# EAGLE design pj9 (EAGLE 7.3.2)
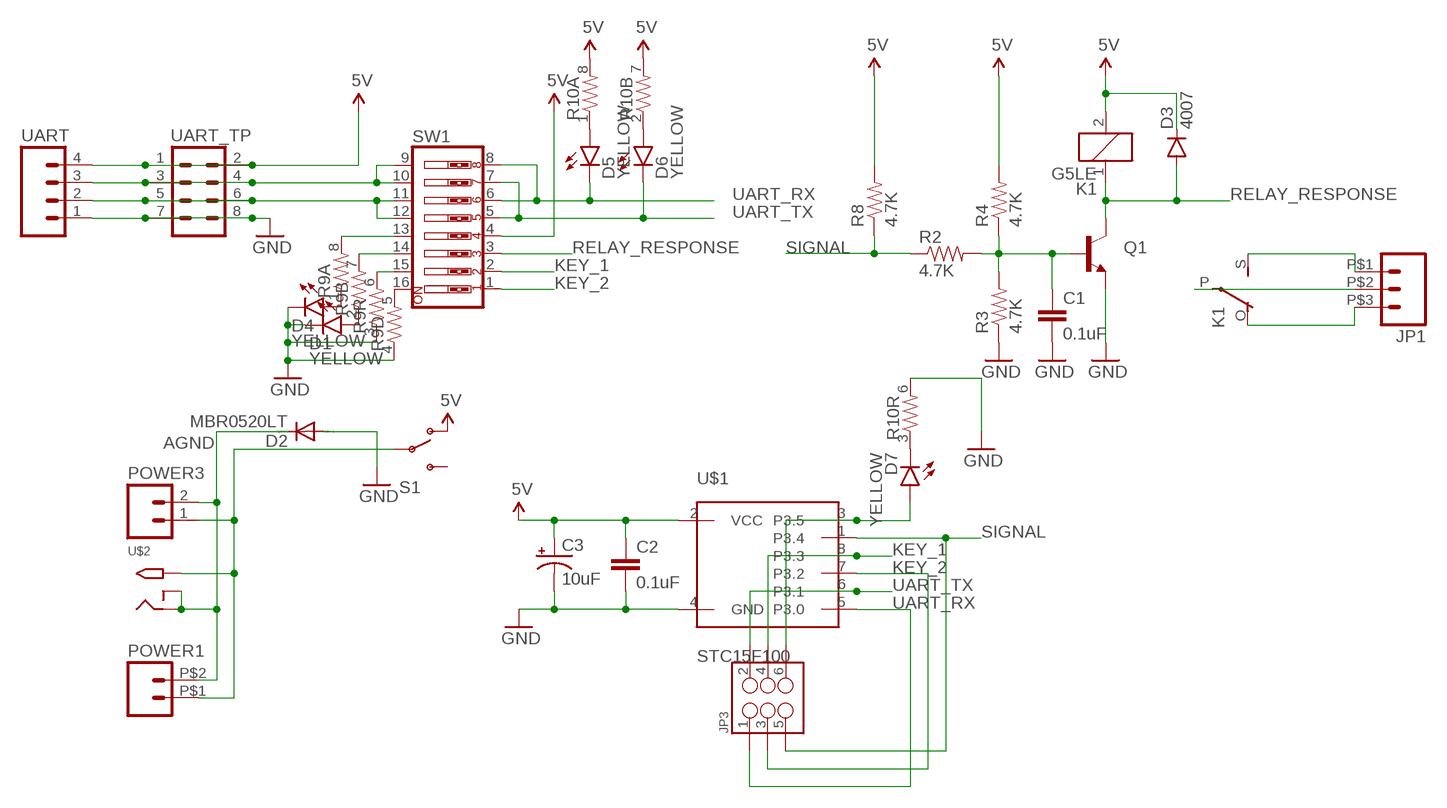
[diagram p0: schematic, sheet 1]

## Parts
C1  0.1uF  0.1UF-25V(+80/-20%)(0603)  [0603-CAP]
C2  0.1uF  0.1UF-25V(+80/-20%)(0603)  [0603-CAP]
C3  10uF  10UF-16V-10%(TANT)  [EIA3216]
D1  YELLOW  LED-YELLOW1206  [LED-1206]
D2  MBR0520LT  [SOD123]
D3  4007  DIODESMA-ALT  [SMA-DIODE_ALT]
D4  YELLOW  LED-YELLOW1206  [LED-1206]
D5  YELLOW  LED-YELLOW1206  [LED-1206]
D6  YELLOW  LED-YELLOW1206  [LED-1206]
D7  YELLOW  LED-YELLOW1206  [LED-1206]
JP1  M035.08  [1X03_5.08]
JP3  M03X2  [2X3_SMD]
K1  G5LE  [G5LE]
POWER1  M02  [1X02_5.08]
POWER3  M02LOCK  [1X02_LOCK]
Q1  TRANSISTOR_NPNSOT23-3  [SOT23-3]
R2  4.7K  470OHM1/10W1%(0603)  [0603-RES]
R3  4.7K  470OHM1/10W1%(0603)  [0603-RES]
R4  4.7K  470OHM1/10W1%(0603)  [0603-RES]
R8  4.7K  470OHM1/10W1%(0603)  [0603-RES]
R9  RESISTOR-ARRAY0603-ARV  [0603-ARV]
R10  RESISTOR-ARRAY0603-ARV  [0603-ARV]
S1  SWITCH-SPDTSMD  [AYZ0202]
SW1  SW_DIP-8-SMT-HALFSIZE  [DIPSWITCH-08-50MIL]
U$1  STC15F100  [SO08-TIGHT]
U$2  2.1MMJACK  [PJ-102A]
UART  M04LOCK  [1X04_LOCK]
UART_TP  M04X2SMD  [2X4_SMD]

## Nets
5V: C2.1 C3.A(+) D3.C K1.2 R4.2 R8.2 R10.7 R10.8 S1.1(O) SW1.4 U$1.2(VCC) UART.4 UART_TP.1 UART_TP.2
AGND: D2.C POWER1.P$2 POWER3.2 U$2.RING U$2.RING_SW
GND: C1.2 C2.2 C3.C(-) D1.C D2.A D4.C Q1.2(E) R3.1 R9.3 R9.4 R10.6 U$1.4(GND) UART.1 UART_TP.7 UART_TP.8
KEY_1: JP3.4 SW1.2 U$1.8(P3.3)
KEY_2: JP3.3 SW1.1 U$1.7(P3.2)
N$3: SW1.11 SW1.12 UART.2 UART_TP.5 UART_TP.6
N$4: R9.8 SW1.13
N$5: R9.5 SW1.16
N$8: SW1.9 SW1.10 UART.3 UART_TP.3 UART_TP.4
N$10: C1.1 Q1.1(B) R2.2 R3.2 R4.1
N$11: R9.7 SW1.14
N$12: JP1.P$2 K1.P(2:P)
N$13: JP1.P$1 K1.S(2:S)
N$14: JP1.P$3 K1.O(2:O)
N$15: R9.6 SW1.15
N$16: D5.A R10.1
N$17: D6.A R10.2
N$18: D4.A R9.1
N$19: D1.A R9.2
N$20: POWER1.P$1 POWER3.1 S1.2(P) U$2.TIP
N$21: D7.C R10.3
N$23: D7.A JP3.6 U$1.3(P3.5)
RELAY_RESPONSE: D3.A K1.1 Q1.3(C) SW1.3
SIGNAL: JP3.5 R2.1 R8.1 U$1.1(P3.4)
UART_RX: D5.C JP3.1 SW1.6 SW1.8 U$1.5(P3.0)
UART_TX: D6.C JP3.2 SW1.5 SW1.7 U$1.6(P3.1)
Unconnected: R10.4 R10.5 S1.3(S)

## Library data of the parts
C1 C2 = SparkFun-Capacitors:0.1UF-25V(+80/-20%)(0603): CAP-00810 Ceramic Standard decoupling cap; PROD_ID: CAP-00810
C3 = SparkFun-Capacitors:10UF-16V-10%(TANT): CAP-00811 1206/EIA-3216 Tantalum capacitor; PROD_ID: CAP-00811
D1 D4-D7 = SparkFun-LED:LED-YELLOW: Yellow SMD LEDs LilyPad 1206- DIO-09909 0603- DIO-09003 "SMART" means more efficient and expensive; PROD_ID: DIO-00820
D2 = diode:MBR0520LT: SCHOTTKY BARRIER RECTIFIER Source: http://onsemi.com .. MBR0520LT1-D.pdf
D3 = SparkFun-DiscreteSemi:DIODE: Diode These are standard reverse protection diodes and small signal diodes. SMA package can handle up to about 1A. SOD-323 can handle about 200mA. What the SOD-323 package when ordering, there are some mfgs out there that are 5-pin packages.
JP1 = SparkFun-Connectors:M03: Header 3 Standard 3-pin 0.1" header. Use with straight break away headers (SKU : PRT-00116), right angle break away headers (PRT-00553), swiss pins (PRT-00743), machine pins (PRT-00117), and female headers (PRT-00115). Molex polarized connector foot print use with SKU : PRT-08232 with associated crimp pins and housings.
JP3 = SparkFun-Connectors:M03X2: 2x3 .1" header. Shrouded, with keying- CONN-10681 SMT- CONN-11415 Pogo pins- HW-11044; PROD_ID: CONN-11290
K1 = relay:G5LE: RELAY 1 x switch, 10 A/120 V AC, 8 A/30 V DC, Omron; OC_FARNELL: unknown; OC_NEWARK: unknown
POWER1 POWER3 = SparkFun-Connectors:M02: Standard 2-pin 0.1" header. Use with - straight break away headers ( PRT-00116) - right angle break away headers (PRT-00553) - swiss pins (PRT-00743) - machine pins (PRT-00117) - female headers (PRT-00115) Molex polarized connector foot print use with: PRT-08233 with associated crimp pins and housings. 2.54_SCREWTERM for use with PRT-10571. 3.5mm Screw Terminal footprints for PRT-08084 5mm Screw Terminal footprints for use with PRT-08432
Q1 = SparkFun-DiscreteSemi:TRANSISTOR_NPN: Generic NPN BJT MMBT2222A - TRANS-08049 (SOT-23, 1A 40V) MPSA42 - TRANS-09116 (SOT-23, 500mA 300V) MMBT5088LT1G - TRANS-11160 (SOT-23, 50 mA 30V) BC547 - COM-08928 <http://www.sparkfun.com/products/8928> (TO-92 45V 100mA) (1.Collector 2.Base 3.Emitter) 2N3904 - COM-00521 <http://www.sparkfun.com/products/521> (TO-92 40V 200mA) (1.Emitter 2.Base 3.Collector) P2N2222A - COM-12852 <http://www.sparkfun.com/products/12852> (TO-92 40V 600mA) (1.Collector 2.Base 3.Emitter); PROD_ID: TRANS-08049
R2-R4 R8 = SparkFun-Resistors:470OHM1/10W1%(0603): RES-07869; PROD_ID: RES-07869; VALUE: 470
R9 R10 = SparkFun-Resistors:RESISTOR-ARRAY: Array Chip Resistor Source: RS Component / Phycomp
S1 = SparkFun-Electromechanical:SWITCH-SPDT: SPDT Switch Simple slide switch, Spark Fun Electronics SKU : COM-00102 DPDT SMT slide switch, AYZ0202, SWCH-08179; PROD_ID: SWCH-08179; SF_ID: COM-00597
SW1 = SparkFun-Electromechanical:SW_DIP-8: DIP Switch 8 Position
U$1 = SparkFun-FreqCtrl:STC15F100
U$2 = adafruit:2.1MMJACK: 2.1mm x 5.5mm DC jack with internal switch. Digikey part #PJ-102A, 4UCON part #05537 By microbuilder.eu
UART = SparkFun-Connectors:M04: Header 4 Standard 4-pin 0.1" header. Use with straight break away headers (SKU : PRT-00116), right angle break away headers (PRT-00553), swiss pins (PRT-00743), machine pins (PRT-00117), and female headers (PRT-00115). Molex polarized connector foot print use with SKU : PRT-08231 with associated crimp pins and housings. 1MM SMD Version SKU: PRT-10208
UART_TP = SparkFun-Connectors:M04X2: .1" header, two rows of four.

## Board
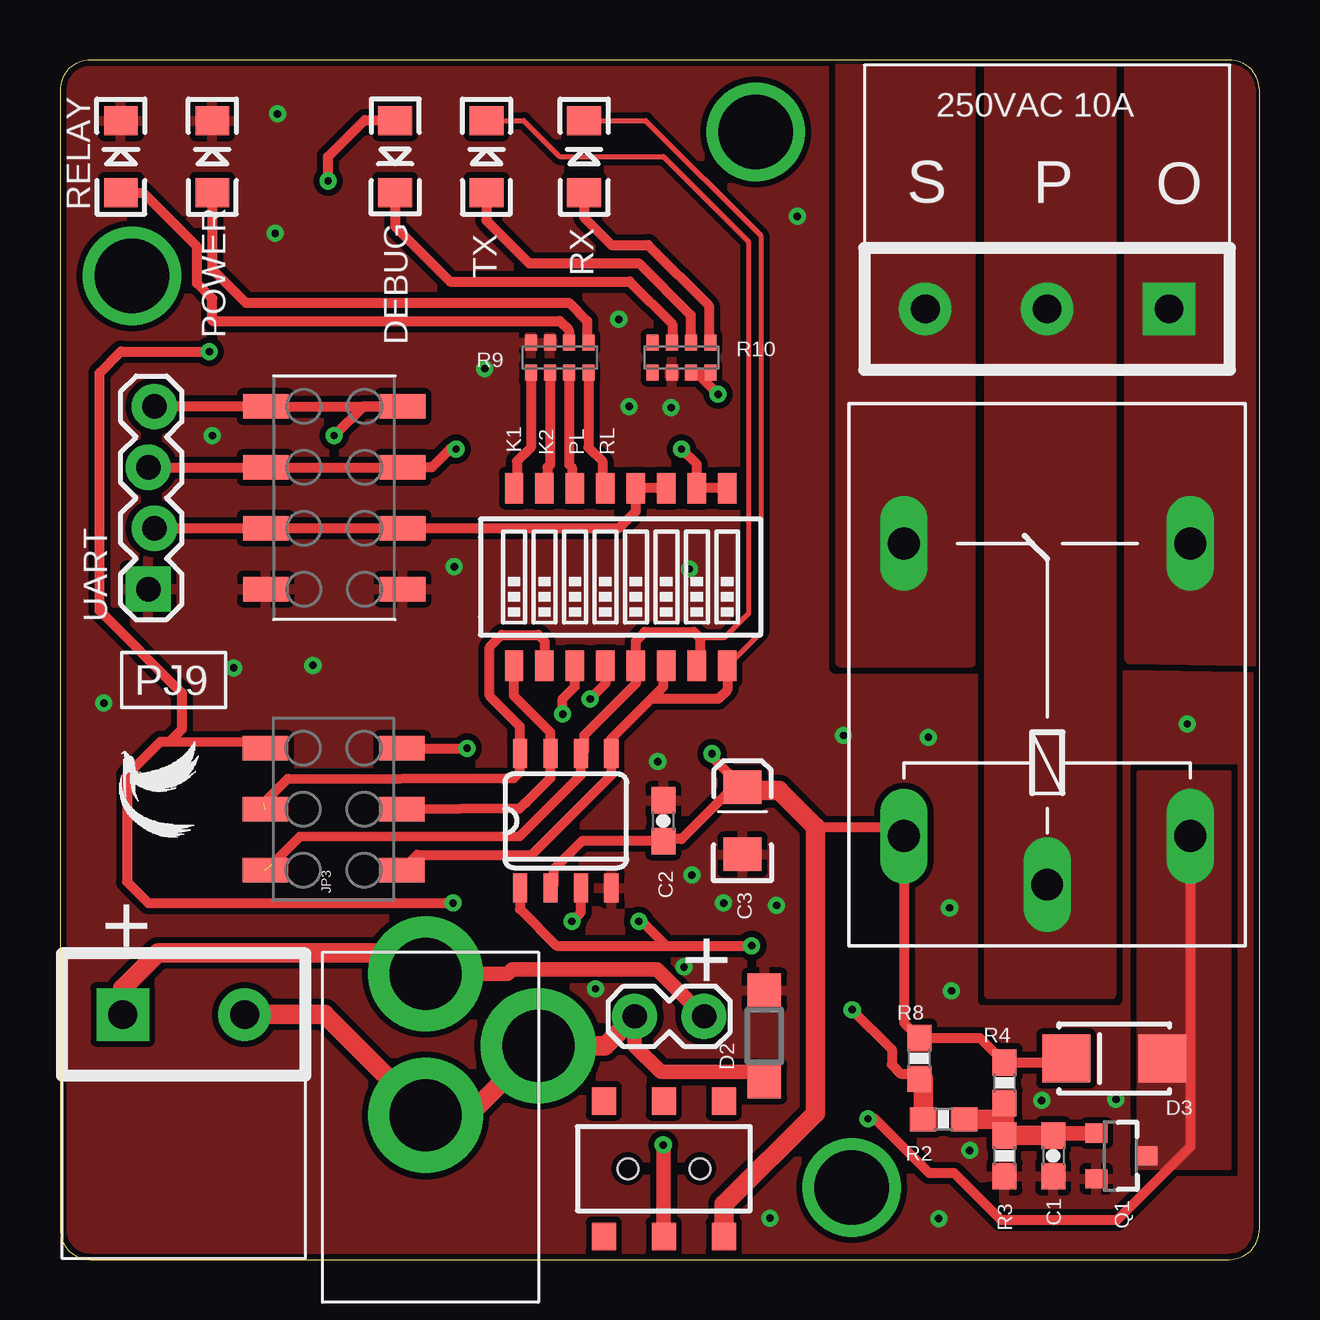
[diagram p1: board, top side]
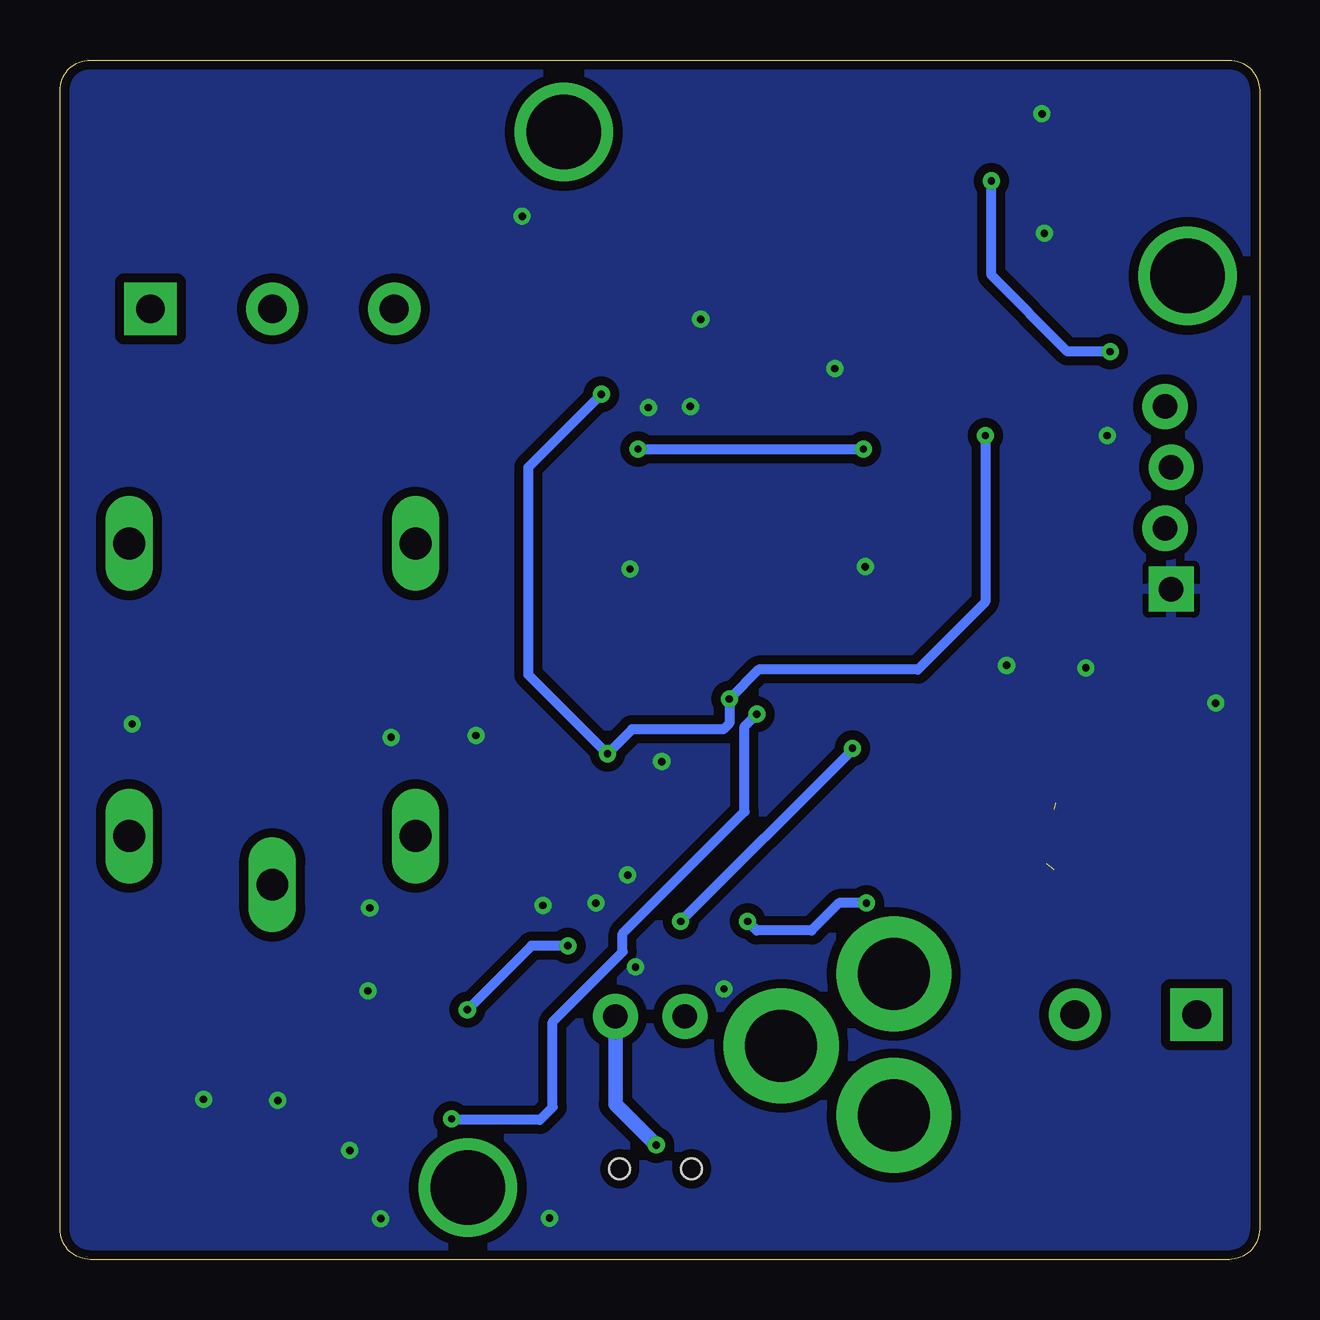
[diagram p2: board, bottom side, seen from below]

Size 50 x 50 mm. Coordinates in mm from the lower left corner, seen from the top.
Outline: 0,48.73 0,1.27 arc90 1.27,0 48.73,0 arc90 50,1.27 50,48.73 arc90 48.73,50 1.27,50 arc90 0,48.73
Copper layers (1*16): Top 0.035mm / dielectric 1.5mm / Bottom 0.035mm
Design rules "default *": minimum track width 6mil, minimum drill 12mil, track to track 6mil, track to pad 6mil, pad to pad 6mil, via to via 6mil, smd to smd 6mil, copper to edge 6mil, drill to drill 6mil, minimum pad ring 10mil, minimum via ring 8mil, stop-mask expansion 0mil, vias tented up to drill 12mil, thermal gap 10mil

### Footprints (pad centres in the part's own frame; a part is rotated, then mirrored left to right if it is on the bottom)
0603-CAP = smd 1.1 x 1: 1 -0.85,0; 2 0.85,0
EIA3216 = smd 1.4 x 1.6: A 1.4,0; C -1.4,0
LED-1206 = smd 1.2 x 1.4: A -1.5,0; C 1.5,0
SOD123 = smd 1.4 x 1.4: A 1.9,0; C -1.9,0
SMA-DIODE_ALT = smd 2 x 2: A -2,0; C 2,0
1X03_5.08 = drill 1.2 pad 2.184 square: P$1 -2.54,0 | drill 1.2 pad 2.184: P$2 2.54,0; P$3 7.62,0
2X3_SMD = smd 1.02 x 1.9: 1 -2.54,-2.85; 2 -2.54,2.85; 3 0,-2.85; 4 0,2.85; 5 2.54,-2.85; 6 2.54,2.85
G5LE = drill 1.321 long: 1 -7.493,-5.969; 2 -7.493,5.969; O 4.699,5.969; P -9.525,0; S 4.699,-5.969
1X02_5.08 = drill 1.2 pad 2.184 square: P$1 -2.54,0 | drill 1.2 pad 2.184: P$2 2.54,0
1X02_LOCK = drill 1.016 pad 1.88: 1 -0.178,0; 2 2.718,0
SOT23-3 = smd 0.8 x 0.9: 1 -0.95,-1; 2 0.95,-1; 3 0,1.1
0603-RES = smd 1.1 x 1: 1 -0.85,0; 2 0.85,0
0603-ARV = smd 0.5 x 0.65: 1 -1.2,-0.625; 2 -0.4,-0.625; 3 0.4,-0.625; 4 1.2,-0.625; 5 1.2,0.625; 6 0.4,0.625; 7 -0.4,0.625; 8 -1.2,0.625
AYZ0202 = smd 1 x 1.15: 1 -2.5,2.825; 2 0,2.825; 3 2.5,2.825; 4 -2.5,-2.825; 5 0,-2.825; 6 2.5,-2.825 | hole 0.85: 1.5,0; -1.5,0
DIPSWITCH-08-50MIL = smd 0.762 x 1.27: 1 -4.445,-3.7; 2 -3.175,-3.7; 3 -1.905,-3.7; 4 -0.635,-3.7; 5 0.635,-3.7; 6 1.905,-3.7; 7 3.175,-3.7; 8 4.445,-3.7; 9 4.445,3.7; 10 3.175,3.7; 11 1.905,3.7; 12 0.635,3.7; 13 -0.635,3.7; 14 -1.905,3.7; 15 -3.175,3.7; 16 -4.445,3.7
SO08-TIGHT = smd 0.6 x 1.2: 1 -1.905,-2.8; 2 -0.635,-2.8; 3 0.635,-2.8; 4 1.905,-2.8; 5 1.905,2.8; 6 0.635,2.8; 7 -0.635,2.8; 8 -1.905,2.8
PJ-102A = drill 3 pad 4.8: RING 0.1,-3.39; RING_SW -4.6,-6.29; TIP 0.1,-9.29
1X04_LOCK = drill 1.016 pad 1.88 square: 1 0,0.127 | drill 1.016 pad 1.88: 2 2.54,-0.127; 3 5.08,0.127; 4 7.62,-0.127
2X4_SMD = smd 1.02 x 1.9: 1 -2.54,-2.85; 2 -2.54,2.85; 3 0,-2.85; 4 0,2.85; 5 2.54,-2.85; 6 2.54,2.85; 7 5.08,-2.85; 8 5.08,2.85

### Placement (x,y rotation side)
C1  41.4,4.32 270 top
C2  25.15,18.29 90 top
C3  28.45,18.29 90 top
D1  2.54,45.97 90 top
D2  29.36,9.32 90 top
D3  43.94,8.38 180 top
D4  6.35,45.97 90 top
D5  21.84,45.97 90 top
D6  17.78,45.97 90 top
D7  13.97,45.97 270 top
JP1  43.69,39.62 180 top
JP3  11.4,18.77 90 top
K1  41.15,25.15 90 top
POWER1  5.16,10.21 0 top
POWER3  26.67,10.13 180 top
Q1  44.2,4.32 270 top
R2  36.83,5.84 0 top
R3  39.37,4.32 90 top
R4  39.37,7.37 90 top
R8  35.81,8.38 90 top
R9  20.83,37.59 180 top
R10  25.91,37.59 180 top
S1  25.17,3.78 180 top
SW1  23.37,28.45 0 top
U$1  21.08,18.29 0 top
U$2  15.34,2.62 180 top
U$3  [LOGO]  2.46,17.58 0 top
UART  3.81,27.94 90 top
UART_TP  11.43,33.02 270 top

### Tracks (layer width: path | path; a pad name or v marks a point on that pad's centre or on a via)
5V  (via drill 0.3)
  Top 0.406: D3.C 41.78,8.22 R4.2 38.35,9.23 R8.2 35.18,9.87 K1.2 34.8,18.03 31.5,18.03 | U$1.2 20.57,15.62 20.57,16.26 21.76,17.44 C2.1 25.23,17.53 25.91,17.53 28.07,19.69 C3.A 27.18,20.96 v27.18,21.08 | SW1.4 22.73,24 v22.1,23.37 | R10.8 R10.7 26.53,36.97 v27.43,36.07 | UART.4 UART_TP.1 UART_TP.2 12.65,35.56 v11.43,34.34
  Top 0.813: S1.1 27.68,2.31 31.5,6.1 31.5,18.03 29.97,19.56 28.58,19.56 C3.A
  Bottom 0.406: v27.43,36.07 30.48,33.02 30.48,24.38 v27.18,21.08 26.16,22.1 22.35,22.1 22.1,22.35 v22.1,23.37 20.88,24.59 14.25,24.59 11.43,27.41 v11.43,34.34
AGND
  Top 0.61: POWER3.2 23.95,8.91 25.04,7.82 28.96,7.82 D2.C
  Top 0.813: POWER1.P$2 11.04,10.21 U$2.RING 17.04,6.01 U$2.RING_SW 22.72,8.91 POWER3.2
GND  (via drill 0.3)
  other vias: 16.43,28.88 24.92,20.75 29.87,14.76 27.66,14.86 26.34,16.03 23.72,35.56 25.48,35.51 23.29,39.19 17.7,37.13 8.97,42.77 9.07,47.75 30.73,43.48 7.24,24.66 10.54,24.77 1.83,23.19 26.01,12.19 22.33,11.28 29.59,1.73 36.63,1.7 37.92,4.55 40.92,6.63 44.02,6.68 37.16,11.2 37.08,14.66 36.2,21.77 32.66,21.84 6.35,34.34 26.24,28.78 46.99,22.33
  pour Bottom (isolate 0.381, rank 5): -0.56,54.48 51.21,54.48 51.21,-0.43 -0.56,-0.43
  pour Top (isolate 0.254, rank 6): -1.91,51.61 53.8,51.61 53.8,-2.72 -1.91,-2.72
KEY_1  (1 unrouted)
  Top 0.406: SW1.2 20.19,25.78 19.94,26.04 18.41,26.04 17.91,25.53 17.91,23.5 19.18,22.23 U$1.8 19.18,20.32 18.92,20.07 9.5,20.04 8.48,19.02
KEY_2
  Top 0.406: SW1.1 18.92,23.5 20.45,21.97 U$1.7 20.45,20.07 19.43,19.05 19.41,19.05 19.15,18.8 JP3.3
N$3
  Top 0.406: UART.2 UART_TP.5 UART_TP.6 23.29,30.48 24,31.19 SW1.12 SW1.11
N$4
  Top 0.406: R9.8 22.03,33.85 22.61,33.27 22.61,32.27 SW1.13
N$5
  Top 0.406: R9.5 19.63,33.85 19.05,33.27 19.05,32.27 SW1.16
N$8  (via drill 0.3)
  Top 0.406: SW1.9 SW1.10 26.54,33.15 v25.91,33.78 | v16.51,33.78 16.26,33.78 15.49,33.02 UART_TP.4 UART_TP.3 UART.3
  Bottom 0.406: v25.91,33.78 v16.51,33.78
N$10
  Top 0.61: Q1.1 41.4,5.27 C1.1
  Top 0.813: R2.2 39.37,5.84 | 39.37,5.84 R4.1 | 39.37,5.84 R3.2 C1.1
N$11
  Top 0.406: R9.7 21.23,33.13 21.34,33.02 21.34,32.27 SW1.14
N$12
  pour Top (no thermals): 38.73,51.05 43.81,51.05 43.81,11.05 38.73,11.05
N$13
  pour Top (no thermals): 44.58,51.05 51.94,50.93 51.94,24.89 44.58,25.02
N$14
  pour Top (no thermals): 37.97,51.05 32.51,51.05 32.51,24.89 37.97,24.89
N$15
  Top 0.406: R9.6 20.43,33.13 20.32,33.02 20.32,32.27 SW1.15
N$16
  Top 0.406: D5.A 21.84,43.43 22.99,42.29 24.51,42.29 27.05,39.75 27.05,38.27 R10.1
N$17
  Top 0.406: D6.A 17.78,43.31 19.56,41.53 24.13,41.53 26.29,39.37 26.29,38.24 R10.2
N$18
  Top 0.406: D4.A 6.35,41.27 7.75,39.88 21.21,39.88 21.97,39.12 21.97,38.27 R9.1
N$19
  Top 0.406: R9.2 21.21,38.24 21.21,38.73 20.83,39.12 6.35,39.12 6.35,40.06 5.71,40.69 5.71,42.22 3.48,44.45 2.56,44.45 D1.A
N$20  (via drill 0.3)
  Top 0.61: U$2.TIP 18.66,11.91 18.85,12.09 24.89,12.09 POWER3.1 | v25.15,4.78 25.15,0.98 S1.2
  Top 0.813: POWER1.P$1 2.62,11.3 4.09,12.78 14.37,12.78 U$2.TIP
  Bottom 0.61: POWER3.1 26.85,6.48 v25.15,4.78
N$21
  Top 0.406: D7.C 13.97,43.05 16.26,40.77 23.75,40.77 25.53,38.99 25.53,38.24 R10.3
N$22  (via drill 3.1)
  other vias: 29,47
N$23  (via drill 0.3)
  Top 0.406: v16.38,14.86 3.68,14.86 2.79,15.75 2.79,20.19 4.19,21.59 4.57,21.59 | v21.34,14.1 21.72,14.48 U$1.3 | v6.22,37.85 2.54,37.85 1.65,36.96 1.65,27.05 5.08,23.62 5.08,22.1 4.57,21.59 | v11.18,44.96 11.18,45.97 12.7,47.5 13.95,47.5 D7.A | 4.57,21.59 8.3,21.57 JP3.6
  Bottom 0.406: v16.38,14.86 17.53,14.86 18.67,13.72 20.95,13.72 v21.34,14.1 | v6.22,37.85 8,37.85 11.18,41.02 v11.18,44.96
N$24  (via drill 3.1)
  other vias: 3,41
N$26  (via drill 3.1)
  other vias: 33,3
RELAY_RESPONSE  (via drill 0.3)
  Top 0.406: K1.1 47.12,4.7 44.07,1.65 39.22,1.65 37.26,3.61 36.22,3.61 33.96,5.87 v33.68,5.87 | v20.95,22.73 20.95,23.37 21.46,23.88 SW1.3
  Bottom 0.406: v20.95,22.73 21.46,22.23 21.46,18.67 26.54,13.59 26.54,12.83 29.46,9.91 29.46,6.35 30,5.82 33.63,5.82 v33.68,5.87
  pour Top (no thermals): 44.96,20.32 48.77,20.32 48.77,3.81 44.96,3.81
SIGNAL  (via drill 0.3)
  Top 0.406: U$1.1 19.18,14.61 20.7,13.08 25.27,13.08 | 25.27,13.08 v28.83,13.08 | v33.02,10.41 34.67,8.76 34.67,8.13 35.05,7.75 35.6,7.75 R8.1 | v24.13,14.1 24.26,14.1 25.27,13.08 | JP3.5 v16.97,21.31
  Top 0.813: R8.1 35.98,7.53 R2.1
  Bottom 0.406: v28.83,13.08 30.35,13.08 v33.02,10.41 | v16.97,21.31 17.14,21.08 v24.13,14.1
UART_RX
  Top 0.203: D5.C 24.41,47.47 29.21,42.67 29.21,26.14 SW1.8
  Top 0.406: 24.64,23.37 22.99,21.72 U$1.5 22.99,20.19 19.66,16.87 14.89,16.87 JP3.1 | 24.64,23.37 25.15,23.88 25.15,24.62 SW1.6 | SW1.8 27.81,23.75 27.43,23.37 24.64,23.37
UART_TX  (1 unrouted)
  Top 0.203: D6.C 19.33,47.47 20.83,45.97 25.15,45.97 28.7,42.42 28.7,26.92 27.69,25.91 26.67,25.91
  Top 0.406: SW1.7 26.67,24.88 26.67,25.91 26.42,26.16 24.38,26.16 24,25.78 SW1.5 24,24 21.84,21.84 21.84,21.21 U$1.6 21.72,20.19 19.18,17.65 10.01,17.63 8.87,16.48

### Text on the board
tNames: 250VAC 10A | RELAY | S | P | O | TX | RX | POWER | DEBUG | K1 | K2 | PL | RL | PJ9 | + | +